# Altium schematic sheet microcontroller.SchDoc
size A
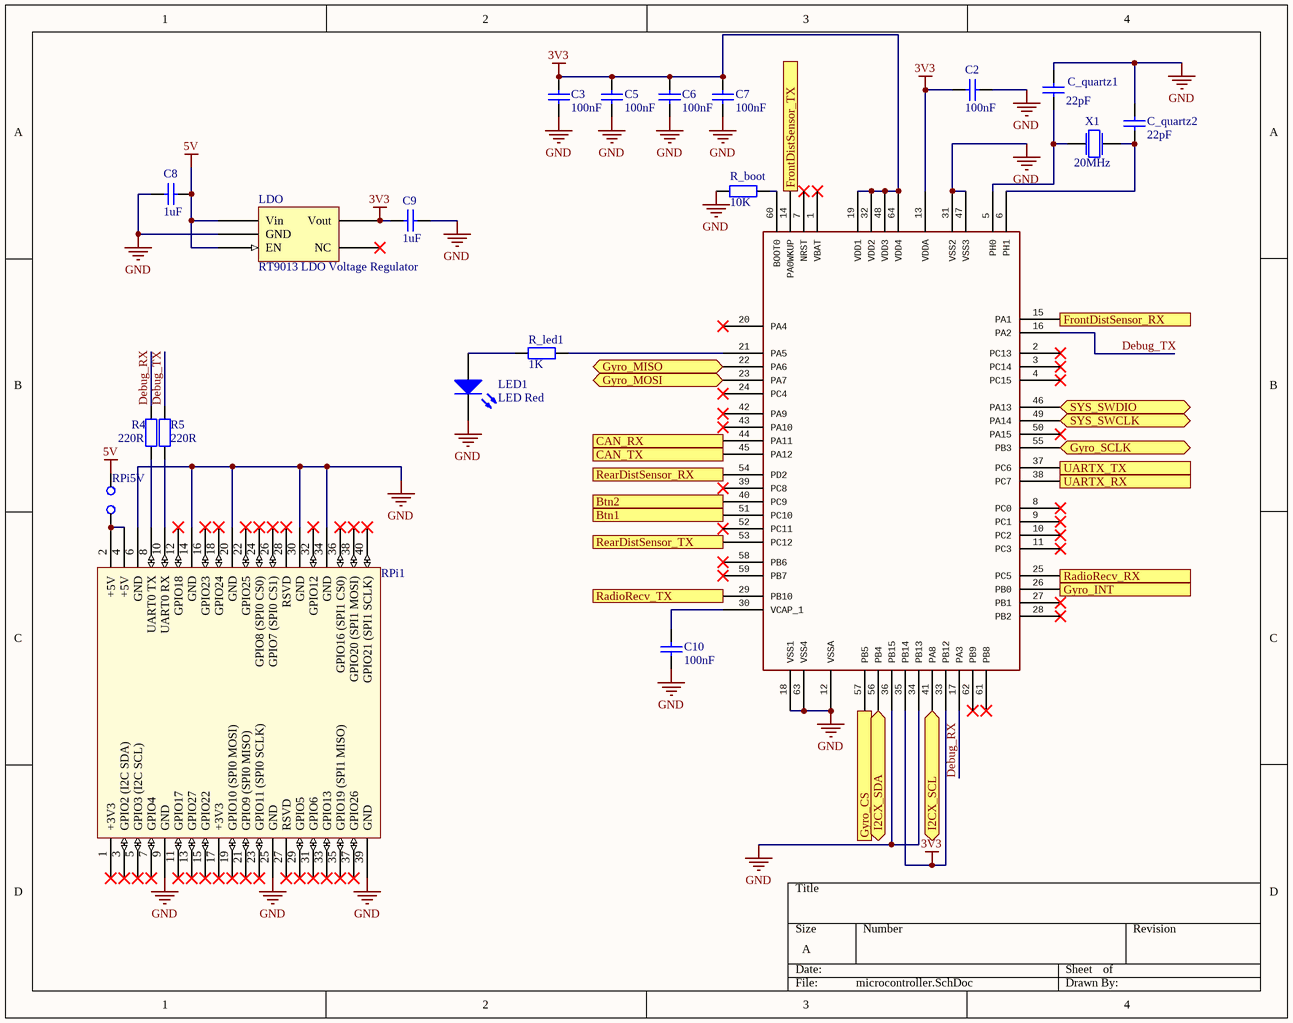
[diagram p0: microcontroller.SchDoc]

## Parts
1  64-pin STM32F4 chip with symbol for Foxcar Control Board v1.  [LQFP64]  (value not drawn)
C2  100nF  [FP_0805_CAP_085]
C3  100nF  [FP_0805_CAP_085]
C5  100nF  [FP_0805_CAP_085]
C6  100nF  [FP_0805_CAP_085]
C7  100nF  [FP_0805_CAP_085]
C8  1uF  [FP_0805_CAP_085]
C9  1uF  [FP_0805_CAP_085]
C10  100nF  [FP_0805_CAP_085]
C_quartz1  22pF  [FP_0805_CAP_085]
C_quartz2  22pF  [FP_0805_CAP_085]
LDO  RT9013 LDO Voltage Regulator  [RT9013_SOT23]
LED1  LED Red  [FP_0805_LED_RED]
R4  220R  [FP_0805_RES]
R5  220R  [FP_0805_RES]
R_boot  10K  [FP_0805_RES]
R_led1  1K  [FP_0805_RES]
RPi1  RPI GPIO Connector  [rpi]  (value not drawn)
RPi5V  (no value)  [JUMPER_2]
X1  20MHz  [FP_CRYSTAL_HC49_SMD]

## Ports
Btn1 (in), Btn2 (in), CAN_RX (in), CAN_TX (out), FrontDistSensor_RX (in), FrontDistSensor_TX (out), Gyro_CS (out), Gyro_INT (in), Gyro_MISO (bidir), Gyro_MOSI (bidir), Gyro_SCLK (bidir), I2CX_SCL (bidir), I2CX_SDA (bidir), RadioRecv_RX (in), RadioRecv_TX (out), RearDistSensor_RX (in), RearDistSensor_TX (out), SYS_SWCLK (bidir), SYS_SWDIO (bidir), UARTX_RX (in), UARTX_TX (out)

## Nets
3V3: 1.13(VDDA) 1.19(VDD1) 1.32(VDD2) 1.33(PB12) 1.35(PB14) 1.48(VDD3) 1.64(VDD4) C2.2 C3.2 C5.2 C6.2 C7.2 C9.1 LDO.Vout
5V: C8.2 LDO.EN LDO.Vin RPi5V.2(C2)
GND: 1.12(VSSA) 1.18(VSS1) 1.31(VSS2) 1.34(PB13) 1.36(PB15) 1.47(VSS3) 1.63(VSS4) C2.1 C3.1 C5.1 C6.1 C7.1 C8.1 C9.2 C10.1 C_quartz1.1 C_quartz2.1 LDO.GND LED1.2(K) R_boot.1 RPi1.6(GND) RPi1.9(GND) RPi1.14(GND) RPi1.20(GND) RPi1.25(GND) RPi1.30(GND) RPi1.34(GND) RPi1.39(GND)
Btn1: 1.51(PC10) ; port Btn1
Btn2: 1.40(PC9) ; port Btn2
CAN_RX: 1.44(PA11) ; port CAN_RX
CAN_TX: 1.45(PA12) ; port CAN_TX
Debug_RX: 1.17(PA3) R4.2
Debug_TX: 1.16(PA2) R5.2
FrontDistSensor_RX: 1.15(PA1) ; port FrontDistSensor_RX
FrontDistSensor_TX: 1.14(PA0WKUP) ; port FrontDistSensor_TX
Gyro_CS: 1.57(PB5) ; port Gyro_CS
Gyro_INT: 1.26(PB0) ; port Gyro_INT
Gyro_MISO: 1.22(PA6) ; port Gyro_MISO
Gyro_MOSI: 1.23(PA7) ; port Gyro_MOSI
Gyro_SCLK: 1.55(PB3) ; port Gyro_SCLK
I2CX_SCL: 1.41(PA8) ; port I2CX_SCL
I2CX_SDA: 1.56(PB4) ; port I2CX_SDA
RadioRecv_RX: 1.25(PC5) ; port RadioRecv_RX
RadioRecv_TX: 1.29(PB10) ; port RadioRecv_TX
RearDistSensor_RX: 1.54(PD2) ; port RearDistSensor_RX
RearDistSensor_TX: 1.53(PC12) ; port RearDistSensor_TX
SYS_SWCLK: 1.49(PA14) ; port SYS_SWCLK
SYS_SWDIO: 1.46(PA13) ; port SYS_SWDIO
UARTX_RX: 1.38(PC7) ; port UARTX_RX
UARTX_TX: 1.37(PC6) ; port UARTX_TX
Net1_5: 1.5(PH0) C_quartz1.2 X1.1
Net1_6: 1.6(PH1) C_quartz2.2 X1.2
Net1_21: 1.21(PA5) R_led1.1
Net1_30: 1.30(VCAP_1) C10.2
Net1_60: 1.60(BOOT0) R_boot.2
NetLED1_1: LED1.1(A) R_led1.2
NetR4_1: R4.1 RPi1.8(UART0_TX)
NetR5_1: R5.1 RPi1.10(UART0_RX)
NetRPi1_2: RPi1.2(+5V) RPi1.4(+5V) RPi5V.1(C1)

Not connected (* = marked no-connect by the designer): 1 1(VBAT)* 2(PC13)* 3(PC14)* 4(PC15)* 7(NRST)* 8(PC0)* 9(PC1)* 10(PC2)* 11(PC3)* 20(PA4)* 24(PC4)* 27(PB1)* 28(PB2)* 39(PC8)* 42(PA9)* 43(PA10)* 50(PA15)* 52(PC11)* 58(PB6)* 59(PB7)* 61(PB8)* 62(PB9)*; LDO NC*; RPi1 1(+3V3)* 3(GPIO2_(I2C_SDA))* 5(GPIO3_(I2C_SCL))* 7(GPIO4)* 11(GPIO17)* 12(GPIO18)* 13(GPIO27)* 15(GPIO22)* 16(GPIO23)* 17(+3V3)* 18(GPIO24)* 19(GPIO10_(SPI0_MOSI))* 21(GPIO9_(SPI0_MISO))* 22(GPIO25)* 23(GPIO11_(SPI0_SCLK))* 24(GPIO8_(SPI0_CS0))* 26(GPIO7_(SPI0_CS1))* 27(RSVD)* 28(RSVD)* 29(GPIO5)* 31(GPIO6)* 32(GPIO12)* 33(GPIO13)* 35(GPIO19_(SPI1_MISO))* 36(GPIO16_(SPI1_CS0))* 37(GPIO26)* 38(GPIO20_(SPI1_MOSI))* 40(GPIO21_(SPI1_SCLK))*

## Library data of the parts
1 = STM32F4R_64PIN_FOXCAR: GateName_1: G$1; SymbolName_1: STM32F4_64PINS_FOXCARV1; LibraryName: stm32f4; DeviceSetName: STM32F4R_64PIN_FOXCAR; Package: LQFP64
C2 C3 C5-C7 C10 = CAP 100nF: Capacitor; Tolerance: +80%/-20%; Voltage: 25V; Reference: 1759167; Name: SMD Multilayer Ceramic Capacitor, 0805; Supplier: Farnell; Value: 100nF
C8 C9 = CAP 1uF: Capacitor; Tolerance: +80%/-20%; Voltage: 25V; Reference: 1828853; Name: SMD Multilayer Ceramic Capacitor, 0805; Supplier: Farnell; Value: 1uF
C_quartz1 C_quartz2 = CAP 22pF: Capacitor; Tolerance: 5%; Voltage: 50V; Reference: 1759195; Name: SMD Multilayer Ceramic Capacitor, 0805; Supplier: Farnell; Value: 22pF
LDO = RT9013: LDO Voltage Regulator
LED1 = LED Red: Red LED; pin to pad: 1>A 2>K; U_fw: 1.85V; I_max: 20mA; Reference: 1581239; Name: MULTICOMP  MCL-S270SRC  LED, Red, SMD, 1.25mm x 1.4mm, 20 mA, 1.85 V, 643 nm; Wavelength: 643nm; Supplier: Farnell
R4 R5 = RES 220R: Resistor; Tolerance: 5%; Power: 125mW; Name: YAGEO (PHYCOMP)  RC0805JR-07220RL  SMD Chip Resistor, Thick Film, 220 ohm; Reference: 9233920; Supplier: Farnell; Value: 220R
R_boot = RES 10K: Resistor; Tolerance: 5%; Power: 125mW; Name: YAGEO (PHYCOMP)  RC0805JR-0710KL  SMD Chip Resistor, Thick Film, 10 kohm; Reference: 9234136; Supplier: Farnell; Value: 10K
R_led1 = RES 1K: Resistor; Tolerance: 5%; Power: 125mW; Name: YAGEO (PHYCOMP)  RC0805JR-071KL  SMD Chip Resistor, Thick Film, 1 kohm; Reference: 9234004; Supplier: Farnell; Value: 1K
RPi1 = rpi connector: GPIO Header for Raspberry Pi A+/B+/Pi 2/Pi 3 - 2x20; Manufacturer: SparkFun Electronics; Manufacturer Part Number: PRT-14017; Nils Minor: author; nilsminor@web.de: mail; RoHS: RoHS Compliant; Category: Development Boards, Kits, Programmers; Stock 1: 150; Pricing 1: 1=1.84 (EUR); Part Status: Active; Accessory Type: Connector; For Use With/Related Products: Raspberry Pi; ComponentLink1URL: https://cdn.sparkfun.com/datasheets/Dev/RaspberryPi/12313.pdf; ComponentLink1Description: https://cdn.sparkfun.com/datasheets/Dev/RaspberryPi/12313.pdf; Supplier 1: Digi-Key; Supplier Part Number 1: 1568-1462-ND
RPi5V = JUMPER_2
X1 = Crystal: Quarz Crystal; Value: 8MHz